# Altium schematic sheet pca10056_sheet7_power_supply.SchDoc: PCA10056 - Power Supply
size A3; Organization: Nordic Semiconductor; DocumentNumber: 7; SheetNumber: 7; SheetTotal: 7; CompanyName: Nordic Semiconductor
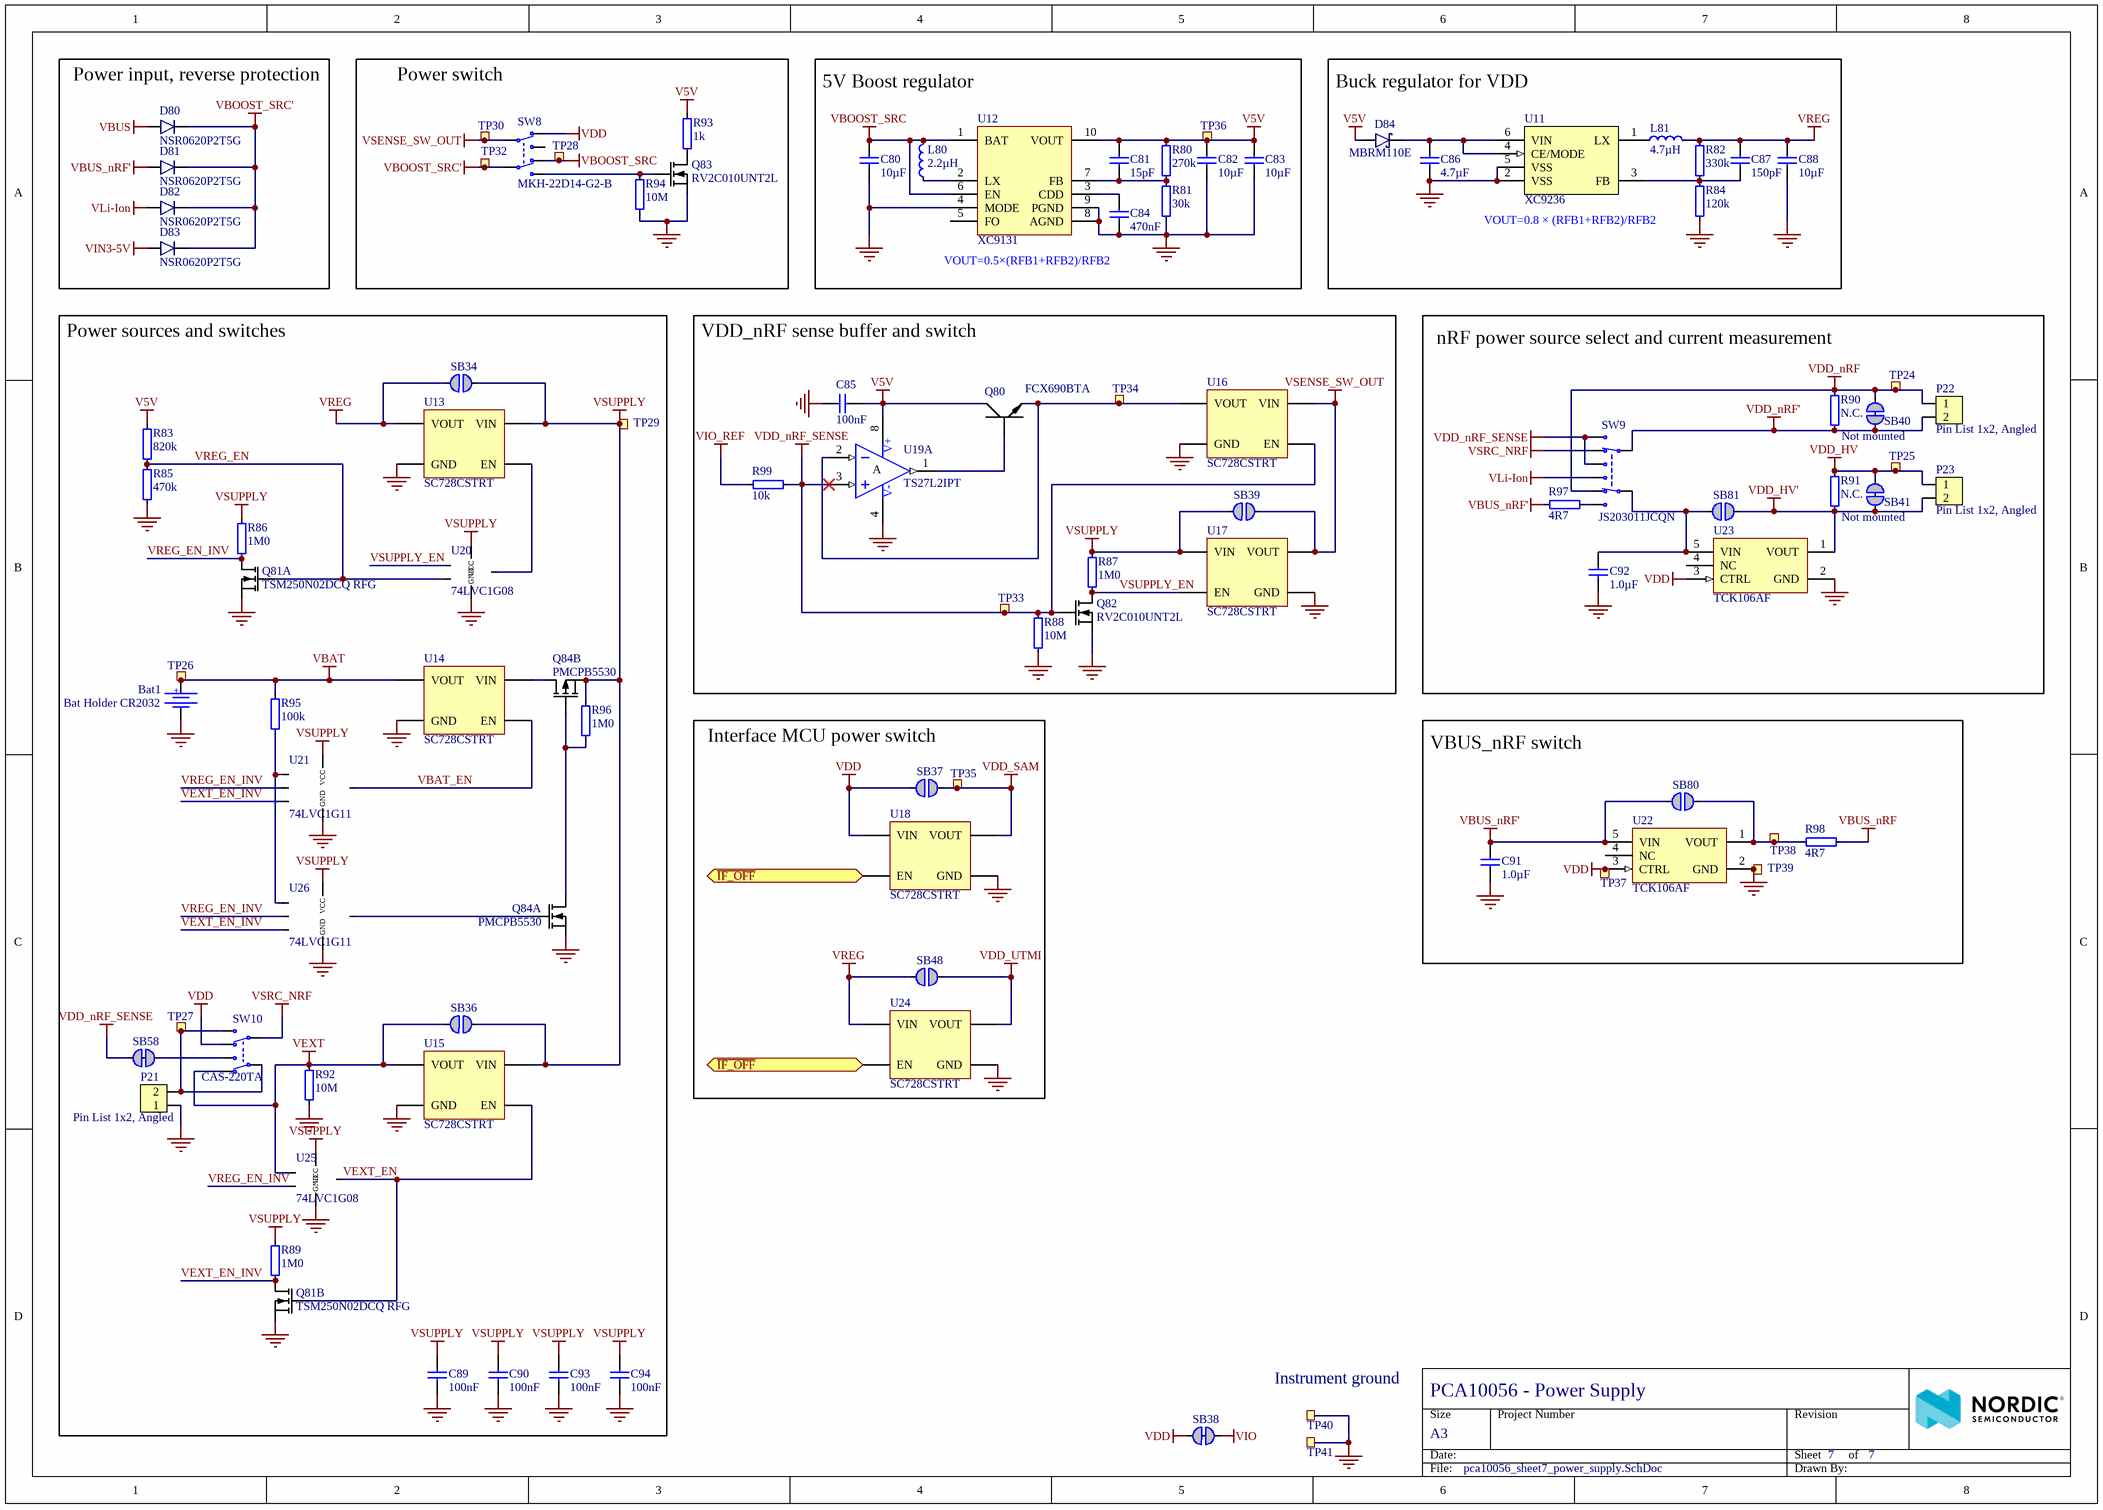
[diagram p0: pca10056_sheet7_power_supply.SchDoc]

## Parts
Bat1  Bat Holder CR2032  [CR2032_HOLDER_RENATA_SMTU_2032-1-LF]
C80  10µF  [CAPC1608X06L]
C81  15pF  [CAPC0603X03L_C]
C82  10µF  [CAPC1608X06L]
C83  10µF  [CAPC1608X06L]
C84  470nF  [CAPC0603X03L_C]
C85  100nF  [CAPC0603X03L_C]
C86  4.7µF  [CAPC2012X11L]
C87  150pF  [CAPC0603X03L_C]
C88  10µF  [CAPC1608X06L]
C89  100nF  [CAPC0603X03L_C]
C90  100nF  [CAPC0603X03L_C]
C91  1.0µF  [CAPC1608X06L]
C92  1.0µF  [CAPC1608X06L]
C93  100nF  [CAPC0603X03L_C]
C94  100nF  [CAPC0603X03L_C]
D80  NSR0620P2T5G  [SODFL100X40-2N]
D81  NSR0620P2T5G  [SODFL100X40-2N]
D82  NSR0620P2T5G  [SODFL100X40-2N]
D83  NSR0620P2T5G  [SODFL100X40-2N]
D84  MBRM110E  [DO-216AA]
L80  2.2µH  [TY-NR3015]
L81  4.7µH  [TY-NR3015]
P21  Pin List 1x2, Angled  [LIST_ANG_1x2-SMD-2.54MM]
P22  Pin List 1x2, Angled  [LIST_ANG_1x2-SMD-2.54MM]
P23  Pin List 1x2, Angled  [LIST_ANG_1x2-SMD-2.54MM]
Q80  FCX690BTA  [SOT89-150P409X160-3N]
Q81  TSM250N02DCQ RFG  [DFN65P200X200X80_HS-6N]  (parts A,B of 2)
Q82  RV2C010UNT2L  [DFN65P100X40-3L]
Q83  RV2C010UNT2L  [DFN65P100X40-3L]
Q84  PMCPB5530  [DFN65P200X200X80_HS-6N]  (parts A,B of 2)
R80  270k  [RESC0603X03L_C]
R81  30k  [RESC0603X03L_C]
R82  330k  [RESC0603X03L_C]
R83  820k  [RESC0603X03L_C]
R84  120k  [RESC0603X03L_C]
R85  470k  [RESC0603X03L_C]
R86  1M0  [RESC0603X03L_C]
R87  1M0  [RESC0603X03L_C]
R88  10M  [RESC0603X03L_C]
R89  1M0  [RESC0603X03L_C]
R90  N.C.  Assembly: Not mounted  [RESC1005X04L]
R91  N.C.  Assembly: Not mounted  [RESC1005X04L]
R92  10M  [RESC0603X03L_C]
R93  1k  [RESC0603X03L_C]
R94  10M  [RESC0603X03L_C]
R95  100k  [RESC0603X03L_C]
R96  1M0  [RESC0603X03L_C]
R97  4R7  [RESC0603X03L_C]
R98  4R7  [RESC0603X03L_C]
R99  10k  [RESC0603X03L_C]
SB34  Solderbridge  [Solderbridge]  (value not drawn)  (no BOM)
SB36  Solderbridge  [Solderbridge]  (value not drawn)  (no BOM)
SB37  Solderbridge  [Solderbridge]  (value not drawn)  (no BOM)
SB38  Solderbridge  [Solderbridge_Shorted]  (value not drawn)  (net tie, no BOM)
SB39  Solderbridge  [Solderbridge]  (value not drawn)  (no BOM)
SB40  Solderbridge  [Solderbridge_Shorted]  (value not drawn)  (net tie, no BOM)
SB41  Solderbridge  [Solderbridge_Shorted]  (value not drawn)  (net tie, no BOM)
SB48  Solderbridge  [Solderbridge]  (value not drawn)  (no BOM)
SB58  Solderbridge  [Solderbridge_Shorted]  (value not drawn)  (net tie, no BOM)
SB80  Solderbridge  [Solderbridge]  (value not drawn)  (no BOM)
SB81  Solderbridge  [Solderbridge]  (value not drawn)  (no BOM)
SW8  MKH-22D14-G2-B  [MKH-22D14-G2-B]
SW9  JS203011JCQN  [Switch-Slide-J-Lead-DP3T-13x3.5mm]
SW10  CAS-220TA  [CAS-220TA]
TP24  Ø1.0mm,SMD  [TP_SMD_Ø1.0mm]  (value not drawn)  (no BOM)
TP25  Ø1.0mm,SMD  [TP_SMD_Ø1.0mm]  (value not drawn)  (no BOM)
TP26  Ø1.0mm,SMD  [TP_SMD_Ø1.0mm]  (value not drawn)  (no BOM)
TP27  Ø1.0mm,SMD  [TP_SMD_Ø1.0mm]  (value not drawn)  (no BOM)
TP28  Ø1.0mm,SMD  [TP_SMD_Ø1.0mm]  (value not drawn)  (no BOM)
TP29  Ø1.0mm,SMD  [TP_SMD_Ø1.0mm]  (value not drawn)  (no BOM)
TP30  Ø1.0mm,SMD  [TP_SMD_Ø1.0mm]  (value not drawn)  (no BOM)
TP32  Ø1.0mm,SMD  [TP_SMD_Ø1.0mm]  (value not drawn)  (no BOM)
TP33  Ø1.0mm,SMD  [TP_SMD_Ø1.0mm]  (value not drawn)  (no BOM)
TP34  Ø1.0mm,SMD  [TP_SMD_Ø1.0mm]  (value not drawn)  (no BOM)
TP35  Ø1.0mm,SMD  [TP_SMD_Ø1.0mm]  (value not drawn)  (no BOM)
TP36  Ø1.0mm,SMD  [TP_SMD_Ø1.0mm]  (value not drawn)  (no BOM)
TP37  Ø1.0mm,SMD  [TP_SMD_Ø1.0mm]  (value not drawn)  (no BOM)
TP38  Ø1.0mm,SMD  [TP_SMD_Ø1.0mm]  (value not drawn)  (no BOM)
TP39  Ø1.0mm,SMD  [TP_SMD_Ø1.0mm]  (value not drawn)  (no BOM)
TP40  TP  [TESTPAD-TH]  (value not drawn)  (no BOM)
TP41  TP  [TESTPAD-TH]  (value not drawn)  (no BOM)
U11  XC9236  [USP-6C]
U12  XC9131  [10-USPB (2.9x2.6)]
U13  SC728CSTRT  [BGA4C40P2X2_76X76X62]
U14  SC728CSTRT  [BGA4C40P2X2_76X76X62]
U15  SC728CSTRT  [BGA4C40P2X2_76X76X62]
U16  SC728CSTRT  [BGA4C40P2X2_76X76X62]
U17  SC728CSTRT  [BGA4C40P2X2_76X76X62]
U18  SC728CSTRT  [BGA4C40P2X2_76X76X62]
U19  TS27L2IPT  [TSOP65P640X120-8N]  (part A of 2)
U20  74LVC1G08  [SOT65P210X100-5N]
U21  74LVC1G11  [SOT65P210X100-6N]
U22  TCK106AF  [SOT95P280X140-5N]
U23  TCK106AF  [SOT95P280X140-5N]
U24  SC728CSTRT  [BGA4C40P2X2_76X76X62]
U25  74LVC1G08  [SOT65P210X100-5N]
U26  74LVC1G11  [SOT65P210X100-6N]

## Blocks framed on the sheet
Power input, reverse protection: D80-D83
Power switch: Q83 R93 R94 SW8 TP28 TP30 TP32
5V Boost regulator: C80-C84 L80 R80 R81 TP36 U12
Buck regulator for VDD: C86-C88 D84 L81 R82 R84 U11
Power sources and switches: Bat1 C89 C90 C93 C94 P21 Q81 Q84 R83 R85 R86 R89 R92 R95 R96 SB34 SB36 SB58 SW10 TP26 TP27 TP29 U13-U15 U20 U21 U25 U26
VDD_nRF sense buffer and switch: C85 Q80 Q82 R87 R88 R99 SB39 TP33 TP34 U16 U17 U19
nRF power source select and current measurement: C92 P22 P23 R90 R91 R97 SB40 SB41 SB81 SW9 TP24 TP25 U23
Interface MCU power switch: SB37 SB48 TP35 U18 U24
VBUS_nRF switch: C91 R98 SB80 TP37-TP39 U22

## Ports
~{IF_OFF} (bidir)

## Nets
GND: Bat1.2 C80.1 C82.1 C83.1 C84.1 C85.1 C86.1 C88.1 C89.1 C90.1 C91.1 C92.1 C93.1 C94.1 P21.1 Q81.1(S1) Q81.4(S2) Q82.2(S) Q83.2(S) Q84.1(S1) R81.1 R84.1 R85.2 R88.2 R92.2 R94.2 TP39.1 TP40.1 TP41.1 U11.2(VSS) U11.5(VSS) U11.7(VSS) U12.4(MODE) U12.8(AGND) U12.9(PGND) U12.11(GND) U13.B1(GND) U14.B1(GND) U15.B1(GND) U16.B1(GND) U17.B1(GND) U18.B1(GND) U19.4(V-) U20.3(GND) U21.2(GND) U22.2(GND) U23.2(GND) U24.B1(GND) U25.3(GND) U26.2(GND)
V5V: C81.2 C82.2 C83.2 C85.2 D84.1(A) Q80.2(C) R80.2 R83.1 R93.1 TP36.1 U12.10(VOUT) U19.8(V+)
VBAT: Bat1.1 R95.1 TP26.1 U14.A1(VOUT)
VBOOST_SRC: C80.2 L80.2 SW8.6(N.C-2) TP28.1 U12.1(BAT) U12.6(EN)
VBOOST_SRC': D80.1(C) D81.1(C) D82.1(C) D83.1(C) SW8.5(COM-2) TP32.1
VBUS: D80.2(A)
VBUS_nRF: R98.2
VBUS_nRF': C91.2 D81.2(A) R97.1 SB80.2 U22.5(VIN)
VDD: SB37.2 SB38.2 SW8.3(N.C-1) SW10.6(N.C-2) TP37.1 U18.A2(VIN) U22.3(CTRL) U23.3(CTRL)
VDD_HV: P23.1 R91.2 SB41.1 TP25.1
VDD_HV': P23.2 R91.1 SB41.2 SB81.1 U23.1(VOUT)
VDD_nRF: P22.1 R90.2 SB40.1 SW9.6(N.C) TP24.1
VDD_nRF': P22.2 R90.1 SB40.2 SW9.3(COM)
VDD_nRF_SENSE: Q82.1(G) R88.1 R99.1 SB58.1 SW9.1(N.O) SW9.4(N.O) TP33.1 U16.B2(EN) U19.3(IN1+)
VDD_SAM: SB37.1 TP35.1 U18.A1(VOUT)
VDD_UTMI: SB48.1 U24.A1(VOUT)
VEXT: R92.1 SB36.2 SW10.3(N.C-1) U15.A1(VOUT) U25.1(A)
VIN3-5V: D83.2(A)
VIO: SB38.1
VIO_REF: R99.2
VLi-Ion: D82.2(A) SW9.5(N.O)
VREG: C87.2 C88.2 L81.2 R82.2 SB34.2 SB48.2 U13.A1(VOUT) U24.A2(VIN)
VSENSE_SW_OUT: SB39.1 SW8.2(COM-1) TP30.1 U16.A2(VIN) U17.A1(VOUT)
VSRC_NRF: SW9.2(N.C) SW10.5(COM-2)
VSUPPLY: C89.2 C90.2 C93.2 C94.2 Q84.4(S2) R86.1 R87.1 R89.1 R96.1 SB34.1 SB36.1 SB39.2 TP29.1 U13.A2(VIN) U15.A2(VIN) U17.A2(VIN) U20.5(VCC) U21.5(VCC) U25.5(VCC) U26.5(VCC)
~{IF_OFF}: U18.B2(EN) U24.B2(EN) ; port ~{IF_OFF}
VBAT_EN: U14.B2(EN) U21.4(Y)
VEXT_EN: Q81.5(G2) U15.B2(EN) U25.4(Y)
VEXT_EN_INV: Q81.3(D2) R89.2 U21.6(C) U26.6(C)
VREG_EN: Q81.2(G1) R83.2 R85.1 U20.2(B)
VREG_EN_INV: Q81.6(D1) R86.2 U21.3(B) U25.2(B) U26.3(B)
VSUPPLY_EN: Q82.3(D) R87.2 U17.B2(EN) U20.1(A)
NetC81_1: C81.1 R80.1 R81.2 U12.7(FB)
NetC84_2: C84.2 U12.3(CDD)
NetC86_2: C86.2 D84.3(C) U11.4(CE/MODE) U11.6(VIN)
NetC87_1: C87.1 R82.1 R84.2 U11.3(FB)
NetC92_2: C92.2 SB81.2 SW9.7(COM) U23.5(VIN)
NetL80_1: L80.1 U12.2(LX)
NetL81_1: L81.1 U11.1(LX)
NetP21_2: P21.2 SW10.2(COM-1) SW10.4(N.O-2) TP27.1
NetQ80_1: Q80.1(B) U19.1(OUT1)
NetQ80_3: Q80.3(E) TP34.1 U16.A1(VOUT) U19.2(IN1-)
NetQ83_1: Q83.1(G) R94.1 SW8.4(N.O-2)
NetQ83_3: Q83.3(D) R93.2
NetQ84_2: Q84.2(G1) U26.4(Y)
NetQ84_3: Q84.3(D2) U14.A2(VIN)
NetQ84_5: Q84.5(G2) Q84.6(D1) R96.2
NetR95_2: R95.2 U21.1(A) U26.1(A)
NetR97_2: R97.2 SW9.8(N.O)
NetR98_1: R98.1 SB80.1 TP38.1 U22.1(VOUT)
NetSB58_2: SB58.2 SW10.1(N.O-1)
NetU13_B2: U13.B2(EN) U20.4(Y)

Not connected (* = marked no-connect by the designer): SW8 1(N.O-1); U12 5(FO); U22 4(NC); U23 4(NC)

## Notes on the sheet
- VOUT=0.8 × (RFB1+RFB2)/RFB2
- VOUT=0.5×(RFB1+RFB2)/RFB2
- (near TP40) Instrument ground
- Size
- Date:
- A3
- Project Number
- Sheet         of
- Revision
- File:
- Drawn By:
- (in symbol Bat Holder Cabcon L-KLS5-CR2032-23-B1) +
- (in symbol TS27L2IPT, part A) A

## Library data of the parts
Bat1 = Bat Holder Cabcon L-KLS5-CR2032-23-B1: Bat Holder CR2032 SMD; Manufacturer: Cabcon; Artikkelnr Noca: N.A.; Part Number: Bat Holder Cabcon L-KLS5-CR2032-23-B1; Manufacturer Part Number: L-KLS5-CR2032-23-B1; Footprint Doc: CR2032_HOLDER; LatestRevisionDate: 2019-07-15; Pin Count: 2; Publisher: Nordic Semiconductor; Published: 2019-07-15; Value: Bat Holder CR2032; Note: Bat Holder CR2032; Part number IPS: N.A.; ComponentLink1URL: *; ComponentLink1Description: Datasheet; ComponentLink2URL: *; ComponentLink2Description: Supplier link; HelpURL: *; Supplier 1: Cabcon; Supplier Part Number 1: L-KLS5-CR2032-23-B1; Supplier 2: Mouser; Supplier Part Number 2: 614-SMTU2032-LF
C80 C82 C83 C88 = C0603-10µ-25V: Capacitor, X5R, ±20%, 25V; Manufacturer: Samsung; Manufacturer Part Number: CL10A106MA8NRNC; Part number IPS: 00000009948; Artikkelnr Noca: 20039436; Part Number: C0603-10µ-25V; Footprint Doc: 0603; LatestRevisionDate: 2015-04-10; Pin Count: 2; Publisher: Nordic Semiconductor; Published: 2015-04-10; Value: 10µF; Note: 25V; ComponentLink1URL: *; ComponentLink1Description: Datasheet; ComponentLink2URL: *; ComponentLink2Description: Supplier link; HelpURL: http://www.samsungsem.com/kr/front/downloadcms.do?path=/kr/support/product-search/mlcc/__icsFiles/afieldfile/2014/11/05&fileName=S_CL10A106MA8NRNC.pdf; Supplier 1: Digi-Key; Supplier Part Number 1: 1276-1869-1-ND; Supplier 2: *; Supplier Part Number 2: *
C81 = C0201-15p: Chip Cap 0201; Note: Chip Cap 1%; Artikkelnr Noca: N.A.; Part Number: C0201-15p; Manufacturer: *; Manufacturer Part Number: *; Footprint Doc: 0201; LatestRevisionDate: 2014-11-13; Pin Count: 2; Publisher: Nordic Semiconductor; Published: 2014-11-13; Value: 15pF; Part number IPS: N.A.; ComponentLink1URL: *; ComponentLink1Description: Datasheet; ComponentLink2URL: *; ComponentLink2Description: Supplier link; HelpURL: *; Supplier 1: *; Supplier Part Number 1: *; Supplier 2: *; Supplier Part Number 2: *
C84 = C0201-470n: Chip Cap 0201; Note: Chip Cap 1%; Artikkelnr Noca: N.A.; Part Number: C0201-470n; Manufacturer: *; Manufacturer Part Number: *; Footprint Doc: 0201; LatestRevisionDate: 2014-11-13; Pin Count: 2; Publisher: Nordic Semiconductor; Published: 2014-11-13; Value: 470nF; Part number IPS: N.A.; ComponentLink1URL: *; ComponentLink1Description: Datasheet; ComponentLink2URL: *; ComponentLink2Description: Supplier link; HelpURL: *; Supplier 1: *; Supplier Part Number 1: *; Supplier 2: *; Supplier Part Number 2: *
C85 C89 C90 C93 C94 = C0201-100n: Capacitor, X5R, ±10%; Part number IPS: 00000001248; Note: 16V; Artikkelnr Noca: N.A.; Part Number: C0201-100n; Manufacturer: *; Manufacturer Part Number: *; Footprint Doc: 0201; LatestRevisionDate: 2017-11-09; Pin Count: 2; Publisher: Nordic Semiconductor; Published: 2014-11-13; Value: 100nF; ComponentLink1URL: *; ComponentLink1Description: Datasheet; ComponentLink2URL: *; ComponentLink2Description: Supplier link; HelpURL: *; Supplier 1: *; Supplier Part Number 1: *; Supplier 2: *; Supplier Part Number 2: *
C86 = C0805-4µ7: Capacitor, X5R, ±10%; Part number IPS: N.A.; Note: 16V; Artikkelnr Noca: 20039266; Part Number: C0805-4µ7; Manufacturer: *; Manufacturer Part Number: *; Footprint Doc: 0805; LatestRevisionDate: 2013-06-04; Pin Count: 2; Publisher: Nordic Semiconductor; Published: 2009-08-21; Value: 4.7µF; ComponentLink1URL: *; ComponentLink1Description: Datasheet; ComponentLink2URL: *; ComponentLink2Description: Supplier link; HelpURL: *; Supplier 1: *; Supplier Part Number 1: *; Supplier 2: *; Supplier Part Number 2: *
C87 = C0201-150p: Chip Cap 0201; Note: Chip Cap 1%; Artikkelnr Noca: N.A.; Part Number: C0201-150p; Manufacturer: *; Manufacturer Part Number: *; Footprint Doc: 0201; LatestRevisionDate: 2014-11-13; Pin Count: 2; Publisher: Nordic Semiconductor; Published: 2014-11-13; Value: 150pF; Part number IPS: N.A.; ComponentLink1URL: *; ComponentLink1Description: Datasheet; ComponentLink2URL: *; ComponentLink2Description: Supplier link; HelpURL: *; Supplier 1: *; Supplier Part Number 1: *; Supplier 2: *; Supplier Part Number 2: *
C91 C92 = C0603-1µ0: Capacitor, X7R, ±10%; Part number IPS: 00000000616; Note: 16V; Artikkelnr Noca: 20039282; Part Number: C0603-1µ0; Manufacturer: *; Manufacturer Part Number: *; Footprint Doc: 0603; LatestRevisionDate: 2013-06-05; Pin Count: 2; Publisher: Nordic Semiconductor; Published: 2009-05-08; Value: 1.0µF; ComponentLink1URL: *; ComponentLink1Description: Datasheet; ComponentLink2URL: *; ComponentLink2Description: Supplier link; HelpURL: *; Supplier 1: *; Supplier Part Number 1: *; Supplier 2: *; Supplier Part Number 2: *
D80-D83 = NSR0620P2T5G: 20V schottky barrier diode, Vf 350 mV @ 100 mA, Ir 2.0 µA @ 10 V, If 500 mA; Manufacturer: ON Semiconductor; Part number IPS: 00000009952; Artikkelnr Noca: 10029169; Part Number: NSR0620P2T5G; Manufacturer Part Number: NSR0620P2T5G; LatestRevisionDate: 2016-07-07; Publisher: Nordic Semiconductor; Published: 2016-07-07; Value: NSR0620P2T5G; Note: *; Footprint Doc: SOD-923; ComponentLink1URL: *; ComponentLink1Description: Datasheet; ComponentLink2URL: *; ComponentLink2Description: Supplier link; HelpURL: http://www.onsemi.com/pub_link/Collateral/NSR0620P2-D.PDF; Pin Count: 2; Supplier 1: Digi-Key; Supplier Part Number 1: NSR0620P2T5GOSCT-ND; Supplier 2: *; Supplier Part Number 2: *
D84 = MBRM110E: Diode Schottky Vf=0.455V @ 100mA, Vr=10V, If=1000mA, Ir=1µA @ 10V; Manufacturer: ON Semiconductor; Manufacturer Part Number: MBRM110ET1G; Part number IPS: N.A.; Artikkelnr Noca: 10029172; Part Number: MBRM110E; Footprint Doc: DO-216AA; LatestRevisionDate: 2016-10-24; Publisher: Nordic Semiconductor; Published: 2016-10-24; Value: MBRM110E; Note: *; ComponentLink1URL: *; ComponentLink1Description: Datasheet; ComponentLink2URL: *; ComponentLink2Description: Supplier link; HelpURL: http://media.digikey.com/pdf/Data%20Sheets/ON%20Semiconductor%20PDFs/MBRM110E-D.pdf; Pin Count: 2; Supplier 1: Digi-Key; Supplier Part Number 1: MBRM110ET1GOSTR-ND; Supplier 2: Farnell; Supplier Part Number 2: 236-9429
L80 = NR3015-2µ2-1.5A-72mOhm: Ferrite Inductor, Shielded, 1,5A, 72mOhm; Manufacturer: Taiyo Yuden; Manufacturer Part Number: NR3015T2R2M; Part number IPS: N.A.; Artikkelnr Noca: 33029487; Part Number: NR3015-2µ2-1.5A-72mOhm; Footprint Doc: 1212; LatestRevisionDate: 2014-01-22; Pin Count: 2; Publisher: Nordic Semiconductor; Published: 2014-01-22; Value: 2.2µH; Note: *; ComponentLink1Description: Datasheet; ComponentLink2Description: Supplier link; ComponentLink1URL: *; ComponentLink2URL: *; HelpURL: http://www.yuden.co.jp/ut/product/category/inductor/NR3015T2R2M.pdf; Supplier 1: Digi-Key; Supplier Part Number 1: 587-1648-1-ND; Supplier 2: Farnell; Supplier Part Number 2: 188-5853
L81 = NR3015-4µ7-1.04A-144mOhm: Ferrite Inductor, Shielded, 1,04A, 144mOhm; Manufacturer: Taiyo Yuden; Manufacturer Part Number: NR3015T4R7M; Part number IPS: 00000009960; Artikkelnr Noca: 33029551; Part Number: NR3015-4µ7-1.04A-144mOhm; Footprint Doc: 1212; LatestRevisionDate: 2014-01-22; Pin Count: 2; Publisher: Nordic Semiconductor; Published: 2014-01-22; Value: 4.7µH; Note: *; ComponentLink1Description: Datasheet; ComponentLink2Description: Supplier link; ComponentLink1URL: *; ComponentLink2URL: *; HelpURL: http://www.yuden.co.jp/ut/product/category/inductor/NR3015T4R7M.pdf; Supplier 1: Digi-Key; Supplier Part Number 1: 587-1649-1-ND; Supplier 2: Mouser; Supplier Part Number 2: 963-NR3015T4R7M
P21-P23 = Pin List Ang 1x2 SMD, 2.54mm: Pin List 1x2, 2.54mm (100mil), Right Angled, SMD; Manufacturer: W-CON; Manufacturer Part Number: 1125B-1102S0Z135R2; Part number IPS: 00000009972; Artikkelnr Noca: 55010023; Part Number: Pin List Ang 1x2 SMD, 2.54mm; Footprint Doc: LIST_ANG_1x2-SMD-2.54MM; LatestRevisionDate: 2016-05-26; Pin Count: 2; Publisher: Nordic Semiconductor; Published: 2016-01-22; Value: Pin List 1x2, Angled; Note: *; ComponentLink1URL: *; ComponentLink1Description: Datasheet; ComponentLink2URL: *; ComponentLink2Description: Supplier link; HelpURL: \\hizz\pro\app9717\Datasheet\connectores\W-CON\1125B-11XXXXZXXXXX.pdf; Supplier 1: Cabcon; Supplier Part Number 1: 1125B-1102S0Z135R2; Supplier 2: Samtec; Supplier Part Number 2: TSM-102-01-L-SH-A
Q80 = FCX690BTA: 45V NPN high gain power transistor; Manufacturer: Diodes Incorporated; Part number IPS: 00000009974; Artikkelnr Noca: 35010019; Part Number: FCX690BTA; Manufacturer Part Number: FCX690BTA; Footprint Doc: SOT-89; LatestRevisionDate: 2016-07-07; Publisher: Nordic Semiconductor; Published: 2016-07-07; Value: FCX690BTA; Note: *; ComponentLink1URL: *; ComponentLink1Description: Datasheet; ComponentLink2URL: *; ComponentLink2Description: Supplier link; HelpURL: http://www.diodes.com/_files/datasheets/FCX690B.pdf; Pin Count: 3; Supplier 1: Digi-Key; Supplier Part Number 1: FCX690BCT-ND; Supplier 2: *; Supplier Part Number 2: *
Q81 = TSM250N02DCQ RFG: Dual N Ch MOFET, 5.8A, 55mOhm max, 620mW; Manufacturer: Taiwan Semiconductor; Part number IPS: 00000001703; Artikkelnr Noca: N.A.; Part Number: TSM250N02DCQ RFG; Manufacturer Part Number: TSM250N02DCQ RFG; LatestRevisionDate: 2018-10-31; Pin Count: 6; Publisher: Nordic Semiconductor; Published: 2018-10-31; Value: TSM250N02DCQ RFG; Note: *; Footprint Doc: VDFN-6; ComponentLink1URL: https://www.taiwansemi.com/products/datasheet/TSM250N02D_B15.pdf; ComponentLink1Description: Datasheet; ComponentLink2URL: *; ComponentLink2Description: Supplier link; HelpURL: https://www.taiwansemi.com/products/datasheet/TSM250N02D_B15.pdf; Supplier 1: Digi-Key; Supplier Part Number 1: TSM250N02DCQRFGCT-ND; Supplier 2: *; Supplier Part Number 2: *
Q82 Q83 = RV2C010UNT2L: N-Channel MOSFET, 20V, 1A, 470mOhm, 400mW; Manufacturer: Rohm Semiconductor; Part number IPS: 00000009976; Artikkelnr Noca: 35010020; Part Number: RV2C010UNT2L; Manufacturer Part Number: RV2C010UNT2L; LatestRevisionDate: 2016-08-09; Publisher: Nordic Semiconductor; Published: 2016-08-09; Value: RV2C010UNT2L; Note: *; Footprint Doc: DFN-3; ComponentLink1URL: *; ComponentLink1Description: Datasheet; ComponentLink2URL: *; ComponentLink2Description: Supplier link; HelpURL: http://rohmfs.rohm.com/en/products/databook/datasheet/discrete/transistor/mosfet/rv2c010unt2l-e.pdf; Pin Count: 3; Supplier 1: Digi-Key; Supplier Part Number 1: RV2C010UNT2LCT-ND; Supplier 2: Mouser; Supplier Part Number 2: 755-RV2C010UNT2L
Q84 = PMCPB5530X,115: Mosfet Array N and P-Channel 20V 4A (Ta), 3.4A (Ta) 490mW Surface Mount 6-HUSON-EP (2x2); Manufacturer: Nexperia; Artikkelnr Noca: N.A.; Part Number: PMCPB5530X,115; Manufacturer Part Number: PMCPB5530X,115; ComponentLink1URL: https://assets.nexperia.com/documents/data-sheet/PMCPB5530X.pdf; ComponentLink1Description: Datasheet; ComponentLink2URL: https://www.digikey.com/product-detail/en/nexperia-usa-inc/PMCPB5530X115/1727-1327-1-ND/4386339; ComponentLink2Description: Supplier link; HelpURL: https://www.nexperia.com/products/mosfets/small-signal-mosfets/PMCPB5530X.html; Footprint Doc: 6-UDFN; LatestRevisionDate: 2018-04-30; Pin Count: 8; Publisher: Nordic Semiconductor; Published: 2018-04-30; Value: PMCPB5530; Note: *; Supplier 1: Digi-Key; Supplier Part Number 1: 1727-1327-1-ND; Supplier 2: Mouser; Supplier Part Number 2: 771-PMCPB5530X115; Part number IPS: N.A.
R80 = R0201-270k: Resistor, ±1%, 0.05W; Note: Chip Res 1%; Artikkelnr Noca: N.A.; Part Number: R0201-270k; Manufacturer: *; Manufacturer Part Number: *; Footprint Doc: 0201; LatestRevisionDate: 2014-11-13; Pin Count: 2; Publisher: Nordic Semiconductor; Published: 2014-11-13; Value: 270k; Part number IPS: N.A.; ComponentLink1URL: *; ComponentLink1Description: Datasheet; ComponentLink2URL: *; ComponentLink2Description: Supplier link; HelpURL: *; Supplier 1: *; Supplier Part Number 1: *; Supplier 2: *; Supplier Part Number 2: *
R81 = R0201-30k: Resistor, ±1%, 0.05W; Note: Chip Res 1%; Artikkelnr Noca: N.A.; Part Number: R0201-30k; Manufacturer: *; Manufacturer Part Number: *; Footprint Doc: 0201; LatestRevisionDate: 2016-04-20; Pin Count: 2; Publisher: Nordic Semiconductor; Published: 2016-04-20; Value: 30k; Part number IPS: N.A.; ComponentLink1URL: *; ComponentLink1Description: Datasheet; ComponentLink2URL: *; ComponentLink2Description: Supplier link; HelpURL: *; Supplier 1: *; Supplier Part Number 1: *; Supplier 2: *; Supplier Part Number 2: *
R82 = R0201-330k: Resistor, ±1%, 0.05W; Part number IPS: 00000001424; Note: Chip Res 1%; Artikkelnr Noca: N.A.; Part Number: R0201-330k; Manufacturer: *; Manufacturer Part Number: *; Footprint Doc: 0201; LatestRevisionDate: 2014-11-13; Pin Count: 2; Publisher: Nordic Semiconductor; Published: 2014-11-13; Value: 330k; ComponentLink1URL: *; ComponentLink1Description: Datasheet; ComponentLink2URL: *; ComponentLink2Description: Supplier link; HelpURL: *; Supplier 1: *; Supplier Part Number 1: *; Supplier 2: *; Supplier Part Number 2: *
R83 = R0201-820k: Resistor, ±1%, 0.05W; Part number IPS: 00000001427; Note: Chip Res 1%; Artikkelnr Noca: N.A.; Part Number: R0201-820k; Manufacturer: *; Manufacturer Part Number: *; LatestRevisionDate: 2014-11-13; Pin Count: 2; Publisher: Nordic Semiconductor; Published: 2014-11-13; Value: 820k; Footprint Doc: 0201; ComponentLink1URL: *; ComponentLink1Description: Datasheet; ComponentLink2URL: *; ComponentLink2Description: Supplier link; HelpURL: *; Supplier 1: *; Supplier Part Number 1: *; Supplier 2: *; Supplier Part Number 2: *
R84 = R0201-120k: Resistor, ±1%, 0.05W; Part number IPS: 00000001425; Note: Chip Res 1%; Artikkelnr Noca: N.A.; Part Number: R0201-120k; Manufacturer: *; Manufacturer Part Number: *; Footprint Doc: 0201; LatestRevisionDate: 2014-11-13; Pin Count: 2; Publisher: Nordic Semiconductor; Published: 2014-11-13; Value: 120k; ComponentLink1URL: *; ComponentLink1Description: Datasheet; ComponentLink2URL: *; ComponentLink2Description: Supplier link; HelpURL: *; Supplier 1: *; Supplier Part Number 1: *; Supplier 2: *; Supplier Part Number 2: *
R85 = R0201-470k: Resistor, ±1%, 0.05W; Part number IPS: 00000001428; Note: Chip Res 1%; Artikkelnr Noca: N.A.; Part Number: R0201-470k; Manufacturer: *; Manufacturer Part Number: *; LatestRevisionDate: 2014-11-13; Pin Count: 2; Publisher: Nordic Semiconductor; Published: 2014-11-13; Value: 470k; Footprint Doc: 0201; ComponentLink1URL: *; ComponentLink1Description: Datasheet; ComponentLink2URL: *; ComponentLink2Description: Supplier link; HelpURL: *; Supplier 1: *; Supplier Part Number 1: *; Supplier 2: *; Supplier Part Number 2: *
R86 R87 R89 R96 = R0201-1M0: Resistor, ±1%, 0.05W; Part number IPS: 00000001418; Note: Chip Res 1%; Artikkelnr Noca: N.A.; Part Number: R0201-1M0; Manufacturer: *; Manufacturer Part Number: *; LatestRevisionDate: 2014-11-13; Pin Count: 2; Publisher: Nordic Semiconductor; Published: 2014-11-13; Value: 1M0; Footprint Doc: 0201; ComponentLink1URL: *; ComponentLink1Description: Datasheet; ComponentLink2URL: *; ComponentLink2Description: Supplier link; HelpURL: *; Supplier 1: *; Supplier Part Number 1: *; Supplier 2: *; Supplier Part Number 2: *
R88 R92 R94 = R0201-10M: Resistor, ±1%, 0.05W; Part number IPS: 00000001426; Note: Chip Res 1%; Artikkelnr Noca: N.A.; Part Number: R0201-10M; Manufacturer: *; Manufacturer Part Number: *; LatestRevisionDate: 2014-11-13; Pin Count: 2; Publisher: Nordic Semiconductor; Published: 2014-11-13; Value: 10M; Footprint Doc: 0201; ComponentLink1URL: *; ComponentLink1Description: Datasheet; ComponentLink2URL: *; ComponentLink2Description: Supplier link; HelpURL: *; Supplier 1: *; Supplier Part Number 1: *; Supplier 2: *; Supplier Part Number 2: *
R90 R91 = R0402-N.C.: Not mounted; Note: Chip Res; Artikkelnr Noca: N.A.; Part Number: R0402-N.C.; Manufacturer: *; Manufacturer Part Number: *; LatestRevisionDate: 2009-05-08; Pin Count: 2; Publisher: Nordic Semiconductor; Published: 2009-05-08; Value: N.C.; Footprint Doc: 0402; Part number IPS: N.A.; ComponentLink1URL: *; ComponentLink1Description: Datasheet; ComponentLink2URL: *; ComponentLink2Description: Supplier link; HelpURL: *; Supplier 1: *; Supplier Part Number 1: *; Supplier 2: *; Supplier Part Number 2: *
R93 = R0201-1k0: Resistor, ±1%, 0.05W; Part number IPS: 00000005786; Note: Chip Res 1%; Artikkelnr Noca: N.A.; Part Number: R0201-1k0; Manufacturer: *; Manufacturer Part Number: *; LatestRevisionDate: 2014-11-13; Pin Count: 2; Publisher: Nordic Semiconductor; Published: 2014-11-13; Value: 1k; Footprint Doc: 0201; ComponentLink1URL: *; ComponentLink1Description: Datasheet; ComponentLink2URL: *; ComponentLink2Description: Supplier link; HelpURL: *; Supplier 1: *; Supplier Part Number 1: *; Supplier 2: *; Supplier Part Number 2: *
R95 = R0201-100k: Resistor, ±1%, 0.05W; Part number IPS: 00000001419; Note: Chip Res 1%; Artikkelnr Noca: N.A.; Part Number: R0201-100k; Manufacturer: *; Manufacturer Part Number: *; LatestRevisionDate: 2014-11-13; Pin Count: 2; Publisher: Nordic Semiconductor; Published: 2014-11-13; Value: 100k; Footprint Doc: 0201; ComponentLink1URL: *; ComponentLink1Description: Datasheet; ComponentLink2URL: *; ComponentLink2Description: Supplier link; HelpURL: *; Supplier 1: *; Supplier Part Number 1: *; Supplier 2: *; Supplier Part Number 2: *
R97 R98 = R0201-4R7: Resistor, ±1%, 0.05W; Note: Chip Res 1%; Artikkelnr Noca: N.A.; Part Number: R0201-4R7; Manufacturer: *; Manufacturer Part Number: *; LatestRevisionDate: 2014-11-13; Pin Count: 2; Publisher: Nordic Semiconductor; Published: 2014-11-13; Value: 4R7; Footprint Doc: 0201; Part number IPS: N.A.; ComponentLink1URL: *; ComponentLink1Description: Datasheet; ComponentLink2URL: *; ComponentLink2Description: Supplier link; HelpURL: *; Supplier 1: *; Supplier Part Number 1: *; Supplier 2: *; Supplier Part Number 2: *
R99 = R0201-10k: Resistor, ±1%, 0.05W; Part number IPS: 00000001255; Note: Chip Res 1%; Artikkelnr Noca: N.A.; Part Number: R0201-10k; Manufacturer: *; Manufacturer Part Number: *; LatestRevisionDate: 2014-11-13; Pin Count: 2; Publisher: Nordic Semiconductor; Published: 2014-11-13; Value: 10k; Footprint Doc: 0201; ComponentLink1URL: *; ComponentLink1Description: Datasheet; ComponentLink2URL: *; ComponentLink2Description: Supplier link; HelpURL: *; Supplier 1: *; Supplier Part Number 1: *; Supplier 2: *; Supplier Part Number 2: *
SB34 SB36 SB37 SB39 SB48 SB80 SB81 = Solderbridge: Artikkelnr Noca: N.A.; Part Number: Solderbridge; Manufacturer: *; Manufacturer Part Number: *; LatestRevisionDate: 2009-12-14; Pin Count: 2; Publisher: Nordic Semiconductor; Published: 2009-12-14; Value: Solderbridge; Note: *; Footprint Doc: Solderbridge; Part number IPS: N.A.; ComponentLink1URL: *; ComponentLink1Description: Datasheet; ComponentLink2URL: *; ComponentLink2Description: Supplier link; HelpURL: *; Supplier 1: *; Supplier Part Number 1: *; Supplier 2: *; Supplier Part Number 2: *
SB38 SB40 SB41 SB58 = Solderbridge Shorted: Shorted Solderbridge; Artikkelnr Noca: N.A.; Part Number: Solderbridge Shorted; Manufacturer: *; Manufacturer Part Number: *; LatestRevisionDate: 2012-08-07; Pin Count: 2; Publisher: Nordic Semiconductor; Published: 2012-08-07; Value: Solderbridge; Note: *; Footprint Doc: Solderbridge_Shorted; Part number IPS: N.A.; ComponentLink1URL: *; ComponentLink1Description: Datasheet; ComponentLink2URL: *; ComponentLink2Description: Supplier link; HelpURL: *; Supplier 1: *; Supplier Part Number 1: *; Supplier 2: *; Supplier Part Number 2: *
SW8 = MKH-22D14-G2-B: Slide Switch DPDT; Manufacturer: Dailywell; Part number IPS: N.A.; Artikkelnr Noca: 50019112; Part Number: MKH-22D14-G2-B; Manufacturer Part Number: MKH-22D14-G2-B; Footprint Doc: MKH-22D14-G2-B; LatestRevisionDate: 2016-08-18; Pin Count: 6; Publisher: Nordic Semiconductor; Published: 2016-08-18; Value: MKH-22D14-G2-B; Note: *; ComponentLink1URL: *; ComponentLink1Description: Datasheet; ComponentLink2URL: *; ComponentLink2Description: Supplier link; HelpURL: \\hizz\pro\app9717\Datasheet\switches\Dailywell\MKH-22D14-G2-B.pdf; Supplier 1: *; Supplier Part Number 1: *; Supplier 2: *; Supplier Part Number 2: *
SW9 = JS203011JCQN: Slide Switch DP3T 300mA 6V; Manufacturer: C&K Components; Part number IPS: N.A.; Artikkelnr Noca: 50019116; Part Number: JS203011JCQN; Manufacturer Part Number: JS203011JCQN; Footprint Doc: Switch-Slide-J-Lead-DP3T-13x3.5mm; LatestRevisionDate: 2016-10-05; Pin Count: 8; Publisher: Nordic Semiconductor; Published: 2016-10-05; Value: JS203011JCQN; Note: *; ComponentLink1URL: *; ComponentLink1Description: Datasheet; ComponentLink2URL: *; ComponentLink2Description: Supplier link; HelpURL: http://www.ckswitches.com/media/1422/js.pdf; Supplier 1: Digi-Key; Supplier Part Number 1: CKN10725CT-ND; Supplier 2: *; Supplier Part Number 2: *
SW10 = CAS-220TA: Slide Switch DPDT J Hook; Manufacturer: Copal Electronics Inc; Part number IPS: 00000009983; Artikkelnr Noca: 50019042; Part Number: CAS-220TA; Manufacturer Part Number: CAS-220TA; Footprint Doc: CAS-220TA; LatestRevisionDate: 2010-02-18; Pin Count: 6; Publisher: Nordic Semiconductor; Published: 2010-02-18; Value: CAS-220TA; Note: *; ComponentLink1URL: *; ComponentLink1Description: Datasheet; ComponentLink2URL: *; ComponentLink2Description: Supplier link; HelpURL: http://media.digikey.com/pdf/Data%20Sheets/COPAL%20Electronics%20PDFs/CAS%20SMD%20Slide%20Switch.pdf; Supplier 1: Digi-Key; Supplier Part Number 1: CAS220JTR-ND; Supplier 2: *; Supplier Part Number 2: *
TP24-TP30 TP32-TP39 = TP_SMD_Ø1.0MM: 1.0mm circular SMD testpad; Manufacturer: Nordic Semiconductor; Artikkelnr Noca: N.A.; Part Number: TP_SMD_Ø1.0MM; Manufacturer Part Number: *; LatestRevisionDate: 2013-06-11; Pin Count: 1; Publisher: Nordic Semiconductor; Published: 2013-06-11; Value: Ø1.0mm,SMD; Note: *; Footprint Doc: TP_SMD_Ø1.0mm; Part number IPS: N.A.; ComponentLink1URL: *; ComponentLink1Description: Datasheet; ComponentLink2URL: *; ComponentLink2Description: Supplier link; HelpURL: *; Supplier 1: *; Supplier Part Number 1: *; Supplier 2: *; Supplier Part Number 2: *
TP40 TP41 = Testpoint TH: Testpoint, through hole; Artikkelnr Noca: N.A.; Part Number: Testpoint TH; Manufacturer: *; Manufacturer Part Number: *; Footprint Doc: TESTPAD-TH; LatestRevisionDate: 2009-12-12; Pin Count: 1; Publisher: Nordic Semiconductor; Published: 2009-12-12; Value: TP; Note: *; Part number IPS: N.A.; ComponentLink1URL: *; ComponentLink1Description: Datasheet; ComponentLink2URL: *; ComponentLink2Description: Supplier link; HelpURL: *; Supplier 1: *; Supplier Part Number 1: *; Supplier 2: *; Supplier Part Number 2: *
U11 = XC9236D08CER-G: 600mA Driver Transistor Built-In, Synchronous Step-Down DC/DC Converters; Manufacturer: Torex Semiconductor; Part number IPS: N.A.; Artikkelnr Noca: 17030085; Part Number: XC9236D08CER-G; Manufacturer Part Number: XC9236D08CER-G; Footprint Doc: USP-6C; LatestRevisionDate: 2017-11-15; Pin Count: 6; Publisher: Nordic Semiconductor; Published: 2017-11-15; Value: XC9236; Note: *; ComponentLink1URL: *; ComponentLink1Description: Datasheet; ComponentLink2URL: *; ComponentLink2Description: Supplier link; HelpURL: http://www.torexsemi.com/products/dcdc_converters/data/XC9235~37.pdf; Supplier 1: Mouser; Supplier Part Number 1: 865-XC9236D08CER-G; Supplier 2: Digi-Key; Supplier Part Number 2: XC9236D08CER-G-ND
U12 = XC9131H05CDR-G: 1A Driver Transistor Built-In, Multi Functional Step-Up DC/DC Converter; Manufacturer: Torex Semiconductor; Part number IPS: N.A.; Artikkelnr Noca: 17030086; Part Number: XC9131H05CDR-G; Manufacturer Part Number: XC9131H05CDR-G; Footprint Doc: UFDFN-10; LatestRevisionDate: 2016-08-08; Pin Count: 10; Publisher: Nordic Semiconductor; Published: 2016-08-08; Value: XC9131; Note: *; ComponentLink1URL: *; ComponentLink1Description: Datasheet; ComponentLink2URL: *; ComponentLink2Description: Supplier link; HelpURL: http://www.torexsemi.com/products/dcdc_converters/data/XC9131.pdf; Supplier 1: Digi-Key; Supplier Part Number 1: XC9131H05CDR-G-ND; Supplier 2: *; Supplier Part Number 2: *
U13-U18 U24 = SC728CSTRT: Semtech, 2A Low Vin, Very Low Ron, Load Switch, 4DSBGA; Manufacturer: Semtech Corporation; Part number IPS: N.A.; Artikkelnr Noca: 15070081; Part Number: SC728CSTRT; Manufacturer Part Number: SC728CSTRT; Footprint Doc: WCSP-4; LatestRevisionDate: 2015-01-01; Pin Count: 4; Publisher: Nordic Semiconductor; Published: 2016-06-16; Value: SC728CSTRT; Note: *; ComponentLink1URL: *; ComponentLink1Description: Datasheet; ComponentLink2URL: *; ComponentLink2Description: Supplier link; HelpURL: http://www.semtech.com/images/datasheet/sc728.pdf; Supplier 1: Digi-Key; Supplier Part Number 1: SC728CSTRTCT-ND; Supplier 2: Mouser; Supplier Part Number 2: 947-SC728CSTRT
U19 = TS27L2IPT: Precision very low power CMOS dual operational amplifier; Manufacturer: STMicroelectronics; Part number IPS: 00000009991; Artikkelnr Noca: 17010019; Part Number: TS27L2IPT; Manufacturer Part Number: TS27L2IPT; Footprint Doc: TSSOP-8; LatestRevisionDate: 2016-07-07; Pin Count: 8; Publisher: Nordic Semiconductor; Published: 2016-07-07; Value: TS27L2IPT; Note: *; ComponentLink1URL: *; ComponentLink1Description: Datasheet; ComponentLink2URL: *; ComponentLink2Description: Supplier link; HelpURL: http://www.st.com/content/ccc/resource/technical/document/datasheet/38/5b/ca/bd/c0/26/4a/34/CD00000880.pdf/files/CD00000880.pdf/jcr:content/translations/en.CD00000880.pdf; Supplier 1: Digi-Key; Supplier Part Number 1: 497-8085-1-ND; Supplier 2: *; Supplier Part Number 2: *
U20 U25 = 74LVC1G08GW: Single 2-Input AND Gate; Manufacturer: NXP Semiconductors; Part number IPS: 00000009992; Artikkelnr Noca: 15049058; Part Number: 74LVC1G08GW; Manufacturer Part Number: 74LVC1G08GW; Footprint Doc: SC70-5; LatestRevisionDate: 2016-10-18; Pin Count: 5; Publisher: Nordic Semiconductor; Published: 2016-10-18; Value: 74LVC1G08; Note: Single 2-Input AND Gate; ComponentLink1URL: *; ComponentLink1Description: Datasheet; ComponentLink2URL: *; ComponentLink2Description: Supplier link; HelpURL: http://www.nxp.com/documents/data_sheet/74LVC1G08.pdf; Supplier 1: Digi-Key; Supplier Part Number 1: 568-1580-1-ND; Supplier 2: Farnell; Supplier Part Number 2: 242-8299
U21 U26 = 74LVC1G11GW: Single 3-input AND gate; Manufacturer: NXP Semiconductors; Part number IPS: 00000001430; Artikkelnr Noca: 15079348; Part Number: 74LVC1G11GW; Manufacturer Part Number: 74LVC1G11GW; Footprint Doc: SC70-6; LatestRevisionDate: 2016-10-18; Pin Count: 6; Publisher: Nordic Semiconductor; Published: 2016-10-18; Value: 74LVC1G11; Note: Single 3-input AND gate; ComponentLink1URL: *; ComponentLink1Description: Datasheet; ComponentLink2URL: *; ComponentLink2Description: Supplier link; HelpURL: http://www.nxp.com/documents/data_sheet/74LVC1G11.pdf; Supplier 1: Digi-Key; Supplier Part Number 1: 568-7757-1-ND; Supplier 2: Farnell; Supplier Part Number 2: 243-8826
U22 U23 = TCK106AF,LF: 1.0 A Load Switch IC with Slew Rate Control Driver in Small Package; Manufacturer: Toshiba; Part number IPS: 00000007823; Artikkelnr Noca: 15070086; Part Number: TCK106AF,LF; Manufacturer Part Number: TCK106AF,LF; Footprint Doc: SOT-25; LatestRevisionDate: 2016-09-29; Pin Count: 5; Publisher: Nordic Semiconductor; Published: 2016-09-29; Value: TCK106AF; Note: *; ComponentLink1URL: *; ComponentLink1Description: Datasheet; ComponentLink2URL: *; ComponentLink2Description: Supplier link; HelpURL: https://toshiba.semicon-storage.com/info/docget.jsp?did=53240&prodName=TCK108AF; Supplier 1: Digi-Key; Supplier Part Number 1: TCK106AFLFCT-ND; Supplier 2: *; Supplier Part Number 2: *